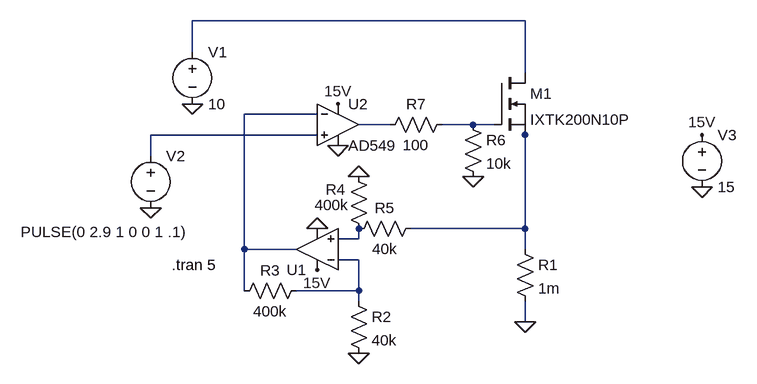
[diagram p0: schematic battery_test_rig_load.asc]
battery_test_rig_load.asc, the LTspice schematic file:
Version 4
SHEET 1 880 680
WIRE 240 16 -272 16
WIRE -272 64 -272 16
WIRE 240 96 240 16
WIRE -80 160 -192 160
WIRE 32 176 -16 176
WIRE 160 176 112 176
WIRE 192 176 160 176
WIRE -80 192 -336 192
WIRE 240 192 240 176
WIRE -336 224 -336 192
WIRE 240 336 240 192
WIRE 240 336 64 336
WIRE -16 352 -16 336
WIRE -16 352 -48 352
WIRE -192 368 -192 160
WIRE -112 368 -192 368
WIRE 240 368 240 336
WIRE -16 384 -48 384
WIRE -192 432 -192 368
WIRE -16 432 -16 384
WIRE -16 432 -112 432
WIRE -16 448 -16 432
WIRE 240 480 240 448
FLAG -48 208 0
FLAG -336 304 0
FLAG -272 144 0
FLAG 512 272 0
FLAG 512 192 15V
FLAG -48 144 15V
FLAG 240 480 0
FLAG -80 336 0
FLAG -16 256 0
FLAG -16 528 0
FLAG -80 400 15V
FLAG 160 256 0
SYMBOL nmos 192 96 R0
SYMATTR InstName M1
SYMATTR Value IXTK200N10P
SYMBOL res 224 352 R0
SYMATTR InstName R1
SYMATTR Value 1m
SYMBOL voltage -272 48 R0
WINDOW 123 0 0 Left 0
WINDOW 39 0 0 Left 0
SYMATTR InstName V1
SYMATTR Value 10
SYMBOL voltage -336 208 R0
WINDOW 3 -200 133 Left 2
WINDOW 123 0 0 Left 0
WINDOW 39 0 0 Left 0
SYMATTR Value PULSE(0 2.9 1 0 0 1 .1)
SYMATTR InstName V2
SYMBOL voltage 512 176 R0
SYMATTR InstName V3
SYMATTR Value 15
SYMBOL Opamps\\UniversalOpamp2 -80 368 R180
SYMATTR InstName U1
SYMBOL res -32 432 R0
SYMATTR InstName R2
SYMATTR Value 40k
SYMBOL res -96 416 R90
WINDOW 0 0 56 VBottom 2
WINDOW 3 32 56 VTop 2
SYMATTR InstName R3
SYMATTR Value 400k
SYMBOL res 0 352 R180
WINDOW 0 36 76 Left 2
WINDOW 3 31 52 Left 2
SYMATTR InstName R4
SYMATTR Value 400k
SYMBOL res -32 352 R270
WINDOW 0 32 56 VTop 2
WINDOW 3 0 56 VBottom 2
SYMATTR InstName R5
SYMATTR Value 40k
SYMBOL res 144 160 R0
SYMATTR InstName R6
SYMATTR Value 10k
SYMBOL Opamps\\AD549 -48 112 R0
SYMATTR InstName U2
SYMBOL res 128 160 R90
WINDOW 0 0 56 VBottom 2
WINDOW 3 32 56 VTop 2
SYMATTR InstName R7
SYMATTR Value 100
TEXT -304 392 Left 2 !.tran 5

The netlist it stands for:
* battery_test_rig_load.asc
M1 N001 N004 N006 N006 IXTK200N10P
R1 N006 0 1m
V1 N001 0 10
V2 N005 0 PULSE(0 2.9 1 0 0 1 .1)
V3 15V 0 15
XU1 N007 N008 15V 0 N002 level.2 Avol=1Meg GBW=10Meg Slew=10Meg ilimit=25m rail=0 Vos=0 phimargin=45 en=0 enk=0 in=0 ink=0 Rin=500Meg  ; pins IN+ IN- V+ V- OUT
R2 N008 0 40k
R3 N008 N002 400k
R4 N007 0 400k
R5 N007 N006 40k
R6 N004 0 10k
XU2 N005 N002 15V 0 N003 AD549  ; pins In+ In- V+ V- OUT
R7 N004 N003 100
.model NMOS NMOS
.model PMOS PMOS
.lib standard.mos
.tran 5
.lib UniversalOpamps2.sub
.backanno
.end